# EasyEDA Pro project Remote_nodeIO_Hardware.eprj

# Schematic Schematic1
Board Name: Board1; Create Date: 2026-08-29; Page Name: P1; Project Name: Remote_nodeIO_Hardware; Schematic Name: Schematic1; Update Date: 2026-09-01; Company: EasyEDA.com; Page Size: A1; Version: V1.0
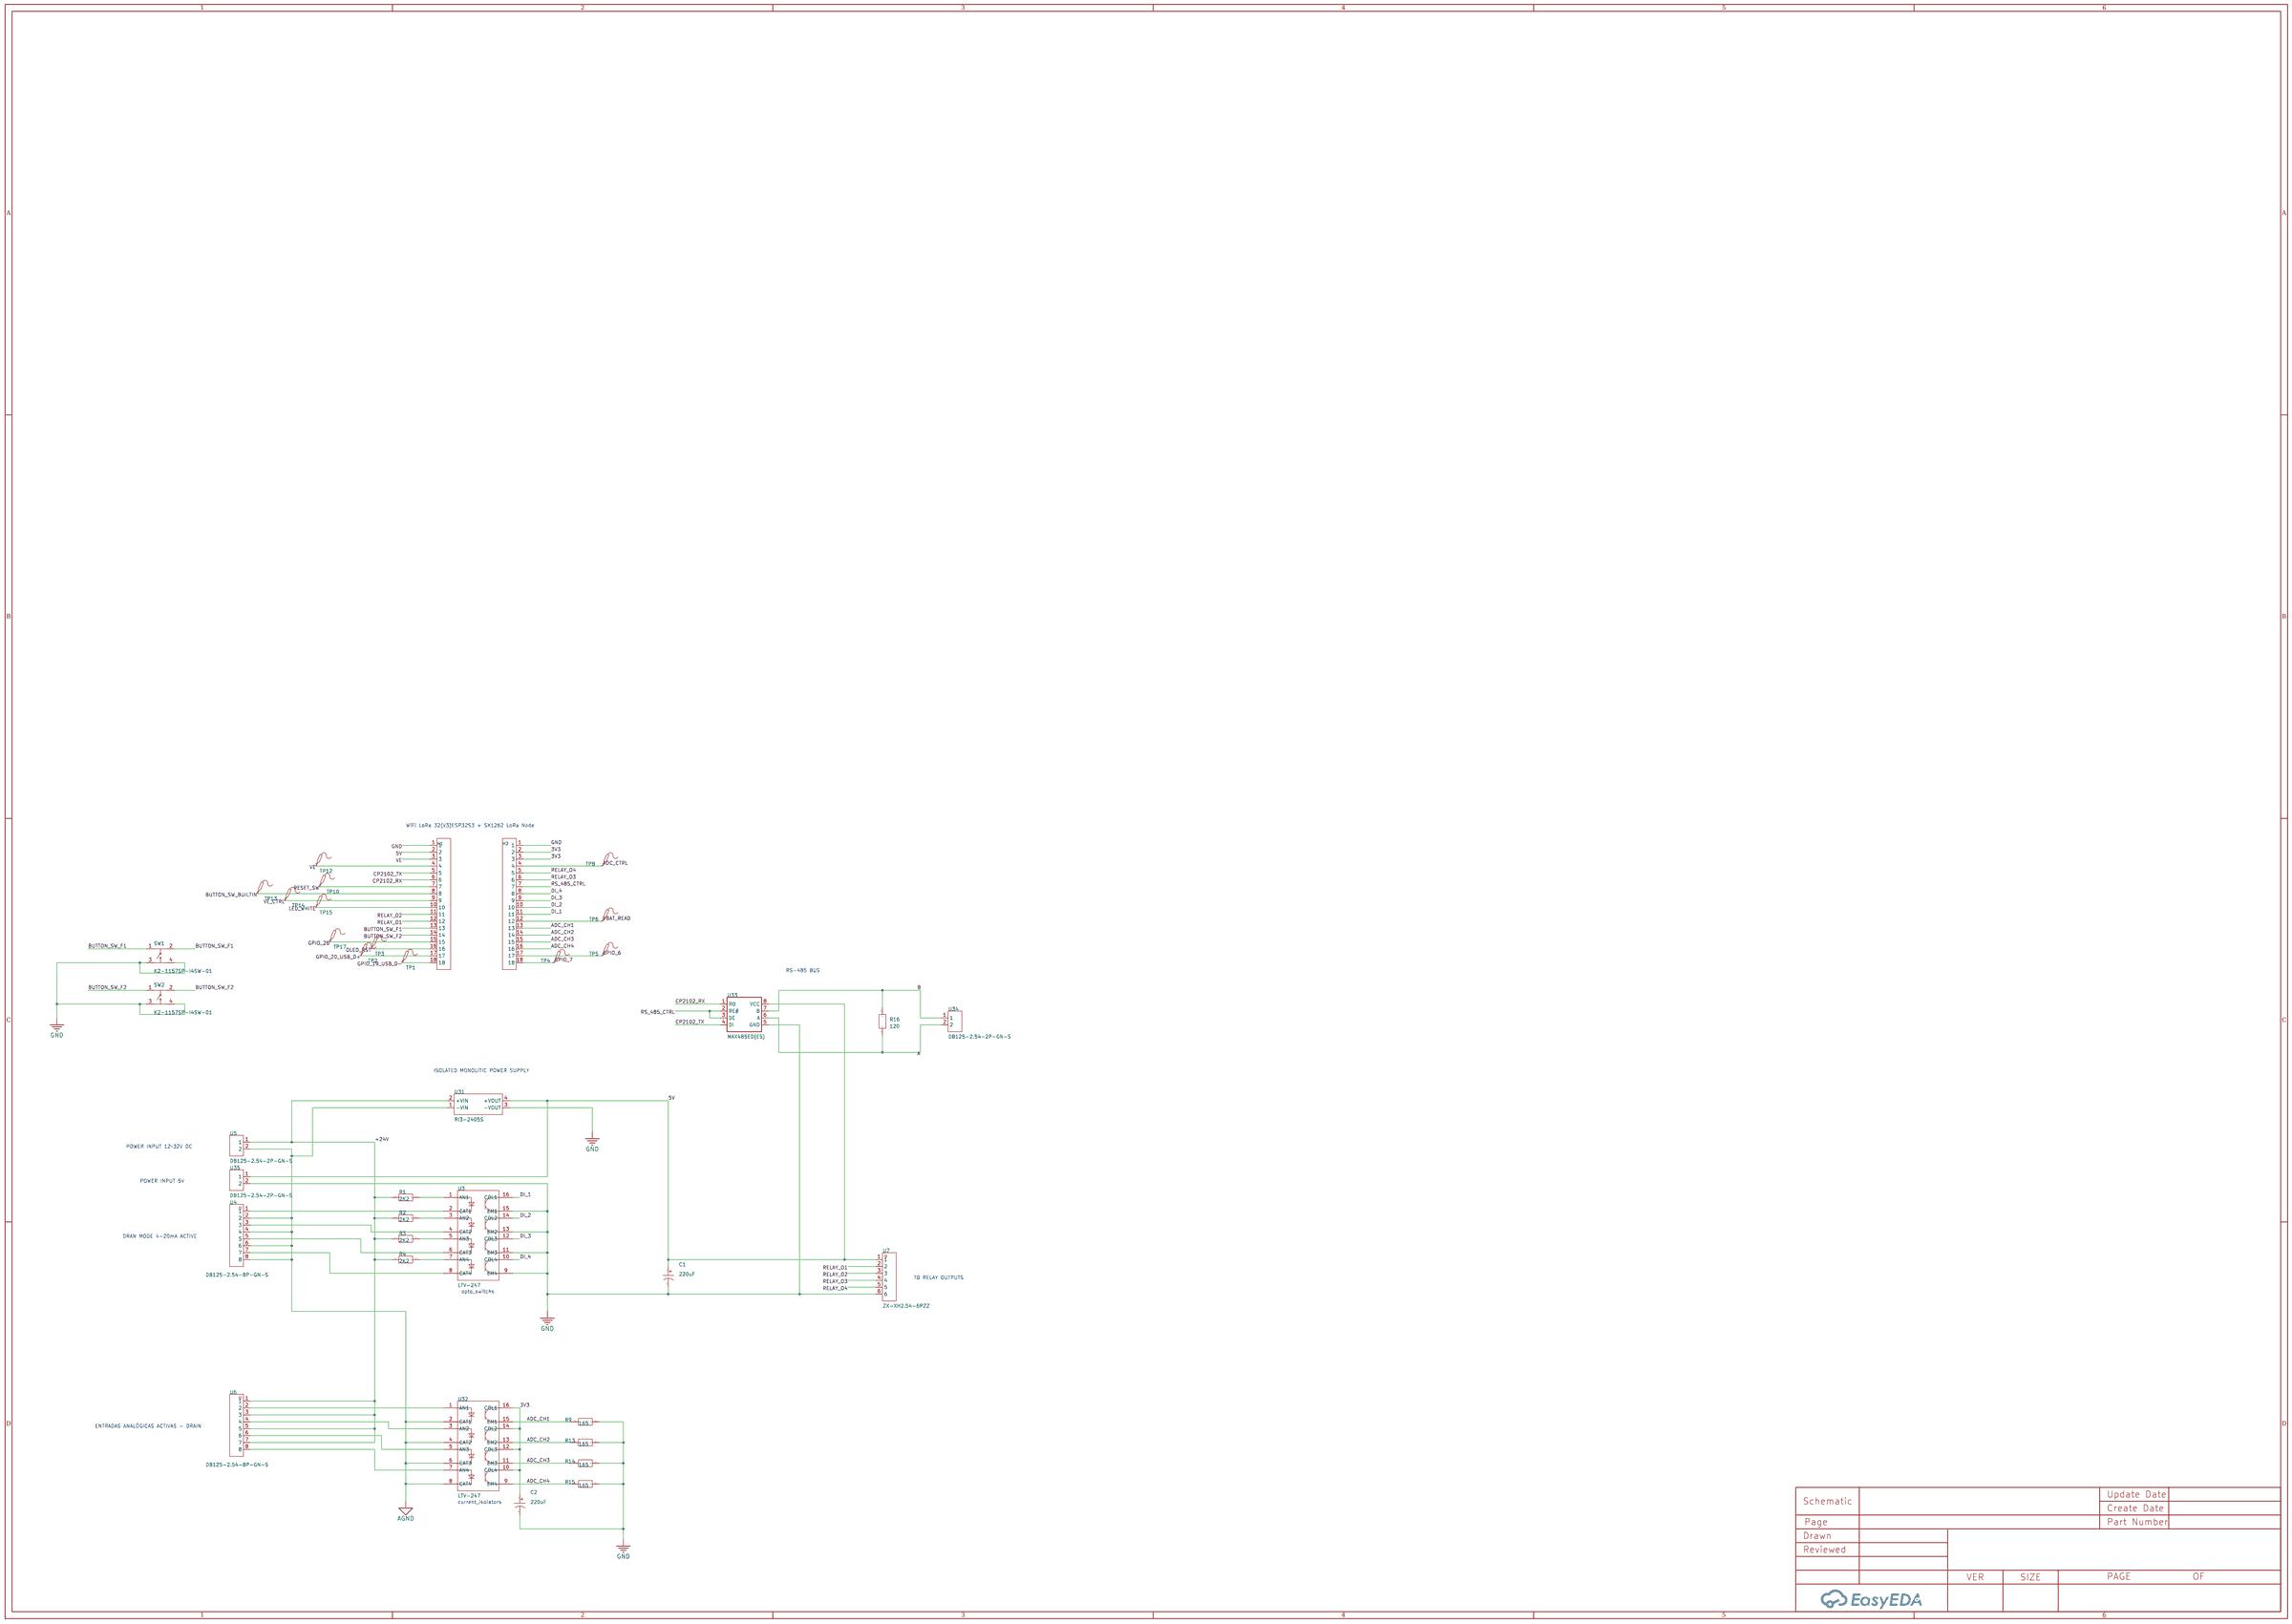
[diagram p0: schematic sheet]

## Parts
C1  220uF  [CAP-SMD_BD6.3-L6.6-W6.6-FD]
C2  220uF  [CAP-SMD_BD6.3-L6.6-W6.6-FD]
H1  PM254-1-18-Z-8.5  [HDR-TH_18P-P2.54-V-F]
H2  PM254-1-18-Z-8.5  [HDR-TH_18P-P2.54-V-F]
R1  2K2  [R1206]
R2  2K2  [R1206]
R3  2K2  [R1206]
R4  2K2  [R1206]
R9  165  [R1206]
R13  165  [R1206]
R14  165  [R1206]
R15  165  [R1206]
R16  120  [R1206]
SW1  K2-1157SP-I4SW-01  [SW-SMD_4P-L6.2-W6.2-P4.50-LS8.6]
SW2  K2-1157SP-I4SW-01  [SW-SMD_4P-L6.2-W6.2-P4.50-LS8.6]
TP1  -  [Test-Point-0.5mm]
TP2  -  [Test-Point-0.5mm]
TP3  -  [Test-Point-0.5mm]
TP4  -  [Test-Point-0.5mm]
TP5  -  [Test-Point-0.5mm]
TP6  -  [Test-Point-0.5mm]
TP8  -  [Test-Point-0.5mm]
TP10  -  [Test-Point-0.5mm]
TP12  -  [Test-Point-0.5mm]
TP13  -  [Test-Point-0.5mm]
TP14  -  [Test-Point-0.5mm]
TP15  -  [Test-Point-0.5mm]
TP17  -  [Test-Point-0.5mm]
U3  LTV-247  [SOP-16_L10.3-W5.4-P1.27-LS7.8-BL]
U4  DB125-2.54-8P-GN-S  [CONN-TH_DB125-2.54-8P-GN]
U5  DB125-2.54-2P-GN-S  [CONN-TH_DB125-2.54-2P-GN]
U6  DB125-2.54-8P-GN-S  [CONN-TH_DB125-2.54-8P-GN]
U7  ZX-XH2.54-6PZZ  [CONN-TH_6P-P2.50_ZX-XH2.54-6PZZ]
U31  RI3-2405S  [PWRM-TH_RI3-XXXXS]
U32  LTV-247  [SOP-16_L10.3-W5.4-P1.27-LS7.8-BL]
U33  MAX485ED(ES)  [SOIC-8_L5.0-W4.0-P1.27-LS6.0-BL]
U34  DB125-2.54-2P-GN-S  [CONN-TH_DB125-2.54-2P-GN]
U35  DB125-2.54-2P-GN-S  [CONN-TH_DB125-2.54-2P-GN]

## Library data of the parts
C1 C2 = RVT1A221M0605_C72494: LCSC Part Name: 220uF ±20% 10V; Supplier Part: C72494; Manufacturer: ROQANG(容强); Manufacturer Part: RVT1A221M0605; Supplier Footprint: SMD,D6.3xL5.4mm; JLCPCB Part Class: Extended Part; Datasheet: https://atta.szlcsc.com/upload/public/pdf/source/20170325/1490427950282.pdf; Supplier: LCSC; Tolerance: ±20%; Voltage Rating: 10V; Ripple Current: 90mA@120Hz; Diameter: 6.3mm; Height - Seated (Max): 5.4mm; Lifetime: 2000hrs@105℃; Operating Temperature: -40℃~+105℃
H1 H2 = PM254-1-18-Z-8.5_C3012090: LCSC Part Name: 1x18P 间距:2.54mm 直插; Supplier Part: C3012090; Manufacturer: HCTL(华灿天禄); Supplier Footprint: 插件,P=2.54mm; JLCPCB Part Class: Extended Part; Datasheet: https://item.szlcsc.com/datasheet/PM254-1-18-Z-8.5/3516561.html; Supplier: LCSC; Holes Structure: 1x18P; Pitch: 2.54mm; Circular Hole / Square Hole: Square Hole; Mounting Type: Through Hole; Number of Rows: 1; Number of Positions: 18P; Current Rating: 3A; Holes Direction: Top; Insulation Height: 8.5mm; Contact Material: Copper alloy; Operating Temperature: -40℃~+105℃
R1-R4 R9 R13-R16 = AS0606J036JT5E: LCSC Part Name: 3.6Ω ±5% 600mW 厚膜电阻; Supplier Part: C2770111; Manufacturer: UNI-ROYAL(厚声); Supplier Footprint: 1216; JLCPCB Part Class: Extended Part; Datasheet: https://item.szlcsc.com/datasheet/AS0606J036JT5E/2908566.html; Supplier: LCSC; Type: Thick Film Resistor; Tolerance: ±5%; Power(Watts): 600mW; Voltage-Supply(Max): 200V; Temperature Coefficient: ±400ppm/℃; Operating Temperature: -55℃~+155℃
SW1 SW2 = K2-1157SP-I4SW-01: LCSC Part Name: 6.4x6.2x3.7红柄开关; Supplier Part: C2909692; Manufacturer: 韩国韩荣; Supplier Footprint: SMD; JLCPCB Part Class: Extended Part; Datasheet: https://item.szlcsc.com/datasheet/K2-1157SP-I4SW-01/3187750.html; Supplier: LCSC; Actuator Style: Round Button; Mounting Type: Surface Mount,Vertical; Contact Current: 50mA; Voltage Rating: 12V; Actuator/Cap Color: Red; With Lamp: Without; Termination Style: Gull Wing; Operating Force: 2.5N; Operating Temperature: -25℃~+80℃; Life: 100,000 Cycles
TP1-TP6 TP8 TP10 TP12-TP15 TP17 = Test-Point
U3 U32 = LTV-247: LCSC Part Name: DC输入 隔离电压(rms):3750V; Supplier Part: C115451; Manufacturer: LITEON(光宝); Supplier Footprint: SOP-16-5.4mm; JLCPCB Part Class: Extended Part; Datasheet: https://item.szlcsc.com/datasheet/LTV-247/116699.html; Supplier: LCSC; Input type: DC; Output Type: Phototransistor; Voltage - Forward(Vf): 1.2V; Output Current: 50mA; Isolation Voltage(Vrms): 3.75kV; Reverse Voltage: 6V; Load Voltage: 80V; Number of Outputs: 4; Vce Saturation(VCE(sat)): 400mV@2.4mA,8mA; Fall time: 3us; Operating Temperature: -55℃~+110℃; Current Transfer Ratio (CTR) Minimum: 100%; Current Transfer Ratio (CTR) Maximum/Saturation Value: 600%; Total Power Dissipation(Pd): 170mW; Forward Current(If): 50mA
U4 U6 = DB125-2.54-8P-GN-S: LCSC Part Name: 1x8P 2.54mm 直插 排数:1 每排P数:8; Supplier Part: C918126; Manufacturer: DORABO(地博电气); Supplier Footprint: 插件,P=2.54mm; JLCPCB Part Class: Extended Part; Datasheet: https://item.szlcsc.com/datasheet/DB125-2.54-8P-GN-S/993705.html; Supplier: LCSC; Number of Positions or Pins: 1x8P; Pitch: 2.54mm; Color: Green; Mounting Type: Through Hole; Number of Pins: 8P; Number of Rows: 1; Number of PINs Per Row: 8; Screw Specification: M1.6; Current Rating: 7A; Voltage Rating (Max): 150V; Wire Gauge - AWG: 18~26; Wire Gauge - mm2: 1; Operating Temperature: -40℃~+105℃; Height Above Board: 8.4mm
U5 U34 U35 = DB125-2.54-2P-GN-S: LCSC Part Name: 1x2P 2.54mm 直插 排数:1 每排P数:2; Supplier Part: C918120; Manufacturer: DORABO(地博电气); Supplier Footprint: 插件,P=2.54mm; JLCPCB Part Class: Extended Part; Datasheet: https://item.szlcsc.com/datasheet/DB125-2.54-2P-GN-S/993699.html; Supplier: LCSC; Number of Positions or Pins: 1x2P; Pitch: 2.54mm; Color: Green; Mounting Type: Through Hole; Number of Pins: 2P; Number of Rows: 1; Number of PINs Per Row: 2; Screw Specification: M1.6; Current Rating: 7A; Voltage Rating (Max): 150V; Wire Gauge - AWG: 18~26; Wire Gauge - mm2: 1; Operating Temperature: -40℃~+105℃; Height Above Board: 8.4mm
U7 = ZX-XH2.54-6PZZ: LCSC Part Name: 1x6P 间距:2.5mm 直插 系列:XH; Supplier Part: C7429636; Manufacturer: Megastar(兆星); Supplier Footprint: 插件,P=2.5mm; JLCPCB Part Class: Extended Part; Datasheet: https://item.szlcsc.com/datasheet/ZX-XH2.54-6PZZ/8427553.html; Supplier: LCSC; Pins Structure: 1x6P; Pitch: 2.5mm; Mounting Type: Through Hole; Reference Series: XH; Number of Pins: 6P; Number of Rows: 1; Number of PINs Per Row: 6; Current Rating: 3A; Contact Material: Brass; Contact Plating: Tin; Operating Temperature: -25℃~+85℃; Voltage Rating: 250V; Plastic Material: PA66; Flame Retardant Rating: UL94V-0; Color: White; Z-Height of the Board: 7mm; X-Length of Bottom Edge on Board (Spacing Line): 17.5mm; Y-Width of Bottom Edge on Board: 5.9mm
U31 = RI3-2405S: Number of Channels:1 Output Power:3W Voltage - Supply:21.6V~26.4V Voltage - Supply:21.6V~26.4V Conversion Efficiency:86% Conversion Efficiency:86% Output Voltage:5V Output Voltage:5V Output Current(Max):600mA Output Current(Max):600mA Isolation Voltage(Vr; Supplier Part: C7049471; Manufacturer: Recom Power; Supplier Footprint: SIP,11.5x7.6mm; JLCPCB Part Class: Extended Part; Datasheet: https://item.szlcsc.com/datasheet/RI3-2405S/8016093.html; Supplier: LCSC; Number of Channels: 1; Output Power: 3W; Voltage - Supply: 21.6V~26.4V; Conversion Efficiency: 86%; Output Voltage: 5V; Output Current(Max): 600mA; Isolation Voltage(Vrms): 1kV
U33 = MAX485ED(ES): LCSC Part Name: 5.0V低功耗，±15kV ESD 保护, 2.5Mbps，半双工，32路负载RS485收发器; Supplier Part: C55471203; Manufacturer: ElecSuper(静芯); Supplier Footprint: SOP-8; JLCPCB Part Class: Extended Part; Datasheet: https://item.szlcsc.com/datasheet/MAX485ED(ES)/59450007.html; Supplier: LCSC

## Nets
3V3: C2.1 H2.2 H2.3 U32.10(COL4) U32.12(COL3) U32.14(COL2) U32.16(COL1)
5V: C1.1 H1.2 U7.1 U31.4(+VOUT) U33.8(VCC) U35.1
+24V: R1.1 R2.1 R3.1 R4.1 U5.1 U6.1 U6.3 U6.5 U6.7 U31.2(+VIN)
AGND: U4.2 U4.4 U4.6 U4.8 U5.2 U31.1(-VIN) U32.2(CAT1) U32.4(CAT2) U32.6(CAT3) U32.8(CAT4)
GND: C1.2 C2.2 H1.1 H2.1 R9.2 R13.2 R14.2 R15.2 SW1.3 SW1.4 SW2.3 SW2.4 U3.9(EM4) U3.11(EM3) U3.13(EM2) U3.15(EM1) U7.6 U31.3(-VOUT) U33.5(GND) U35.2
VBAT_READ: H2.12 TP6.1
A: R16.1 U33.6(A) U34.2
ADC_CH1: H2.13 R9.1 U32.15(EM1)
ADC_CH2: H2.14 R13.1 U32.13(EM2)
ADC_CH3: H2.15 R14.1 U32.11(EM3)
ADC_CH4: H2.16 R15.1 U32.9(EM4)
ADC_CTRL: H2.4 TP8.1
B: R16.2 U33.7(B) U34.1
BUTTON_SW_BUILTIN: H1.8 TP13.1
BUTTON_SW_F1: H1.13 SW1.1 SW1.2
BUTTON_SW_F2: H1.14 SW2.1 SW2.2
CP2102_RX: H1.6 U33.1(RO)
CP2102_TX: H1.5 U33.4(DI)
DI_1: H2.11 U3.16(COL1)
DI_2: H2.10 U3.14(COL2)
DI_3: H2.9 U3.12(COL3)
DI_4: H2.8 U3.10(COL4)
GPIO_6: H2.17 TP5.1
GPIO_7: H2.18 TP4.1
GPIO_19_USB_D-: H1.18 TP1.1
GPIO_20_USB_D+: H1.17 TP2.1
GPIO_26: H1.15 TP17.1
LED_WHITE: H1.10 TP15.1
OLED_RST: H1.16 TP3.1
RELAY_O1: H1.12 U7.2
RELAY_O2: H1.11 U7.3
RELAY_O3: H2.6 U7.4
RELAY_O4: H2.5 U7.5
RESET_SW: H1.7 TP10.1
RS_485_CTRL: H2.7 U33.2(RE#) U33.3(DE)
VE: H1.3 H1.4 TP12.1
VE_CTRL: H1.9 TP14.1
$R1_2: R1.2 U3.1(AN1)
$R2_2: R2.2 U3.3(AN2)
$R3_2: R3.2 U3.5(AN3)
$R4_2: R4.2 U3.7(AN4)
$U3_2: U3.2(CAT1) U4.1
$U3_4: U3.4(CAT2) U4.3
$U3_6: U3.6(CAT3) U4.5
$U3_8: U3.8(CAT4) U4.7
$U32_1: U6.2 U32.1(AN1)
$U32_3: U6.4 U32.3(AN2)
$U32_5: U6.6 U32.5(AN3)
$U32_7: U6.8 U32.7(AN4)

## Notes on the sheet
- WiFi LoRa 32(V3)ESP32S3 + SX1262 LoRa Node
- RS-485 BUS
- ISOLATED MONOLITIC POWER SUPPLY
- POWER INPUT 12~32V DC
- POWER INPUT 5V
- DRAN MODE 4-20mA ACTIVE
- TO RELAY OUTPUTS
- opto_switchs
- ENTRADAS ANALÓGICAS ACTIVAS - DRAIN
- current_isolators

# Board PCB1
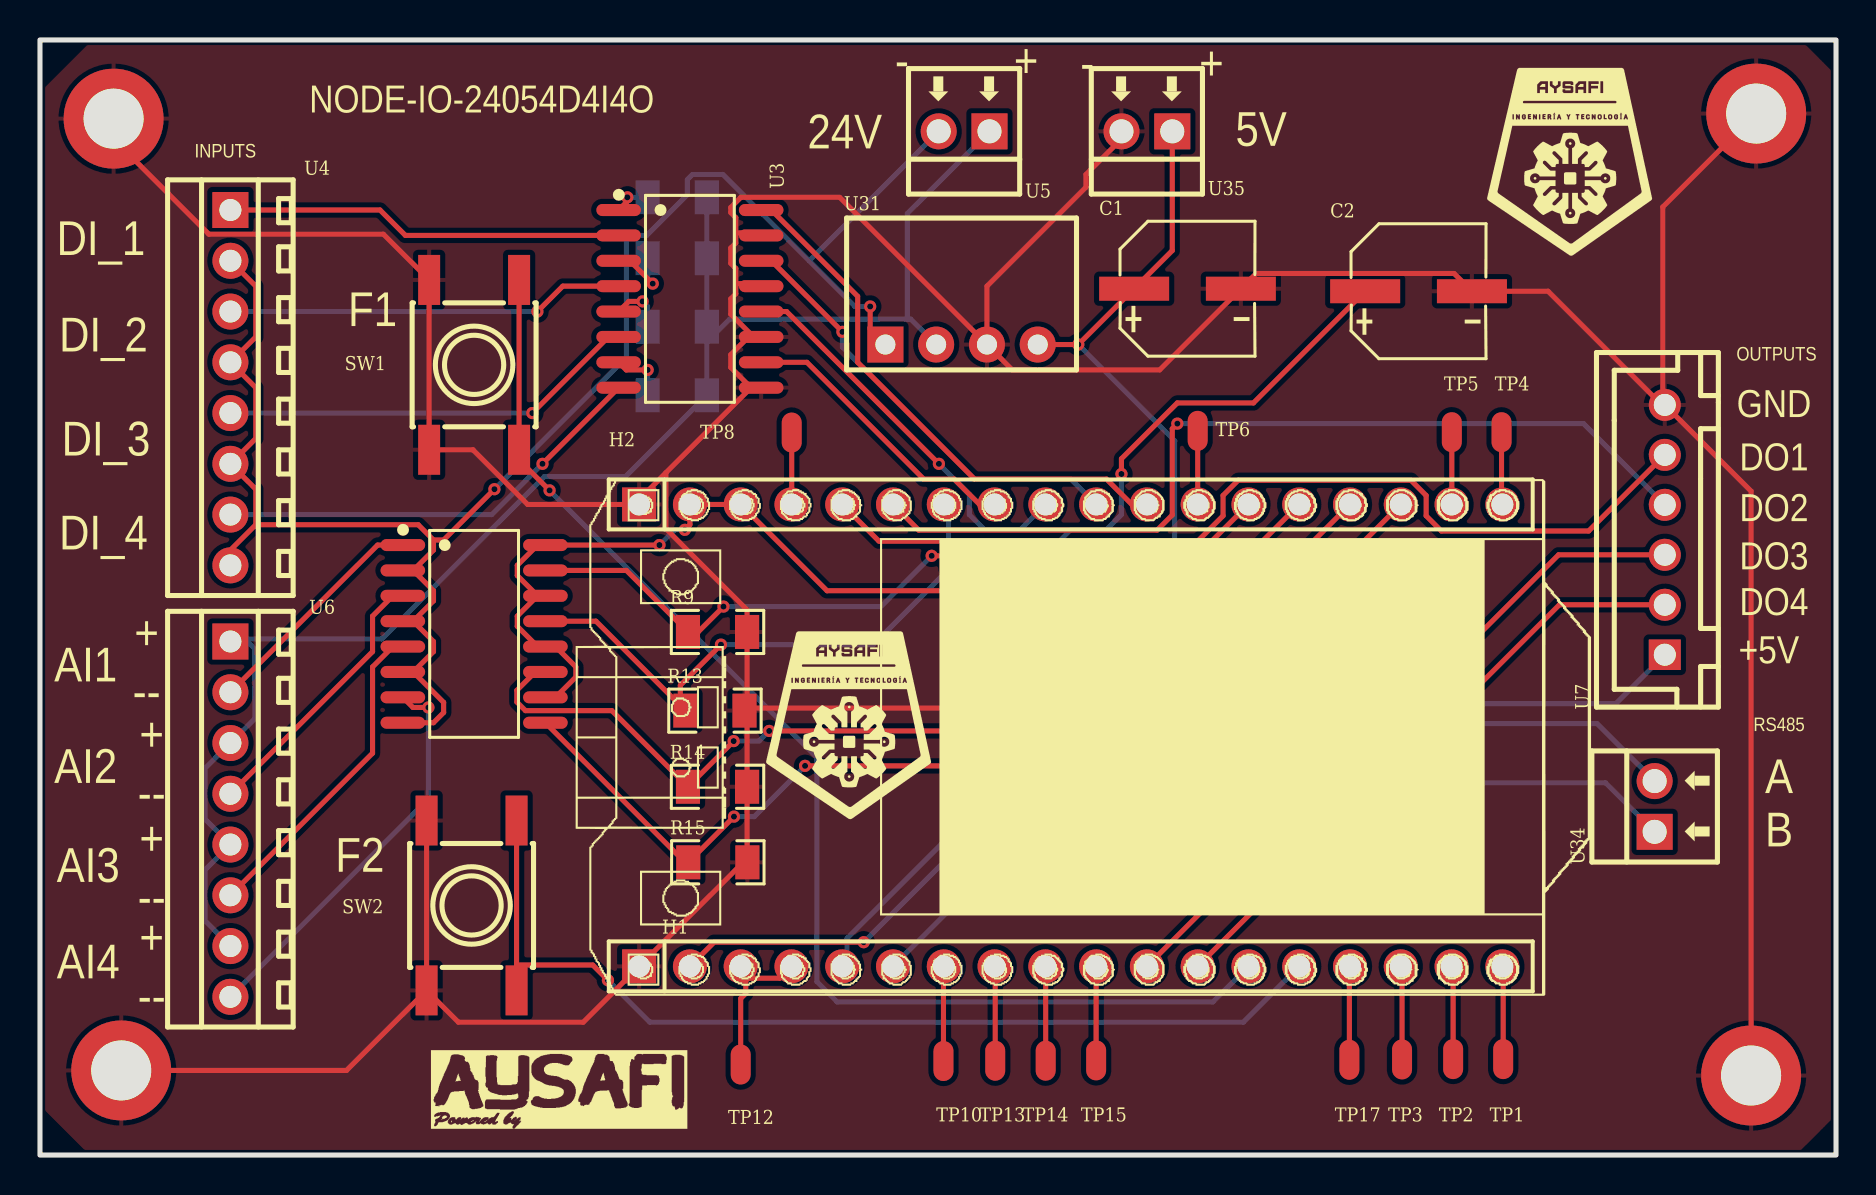
[diagram p1: board, top side]
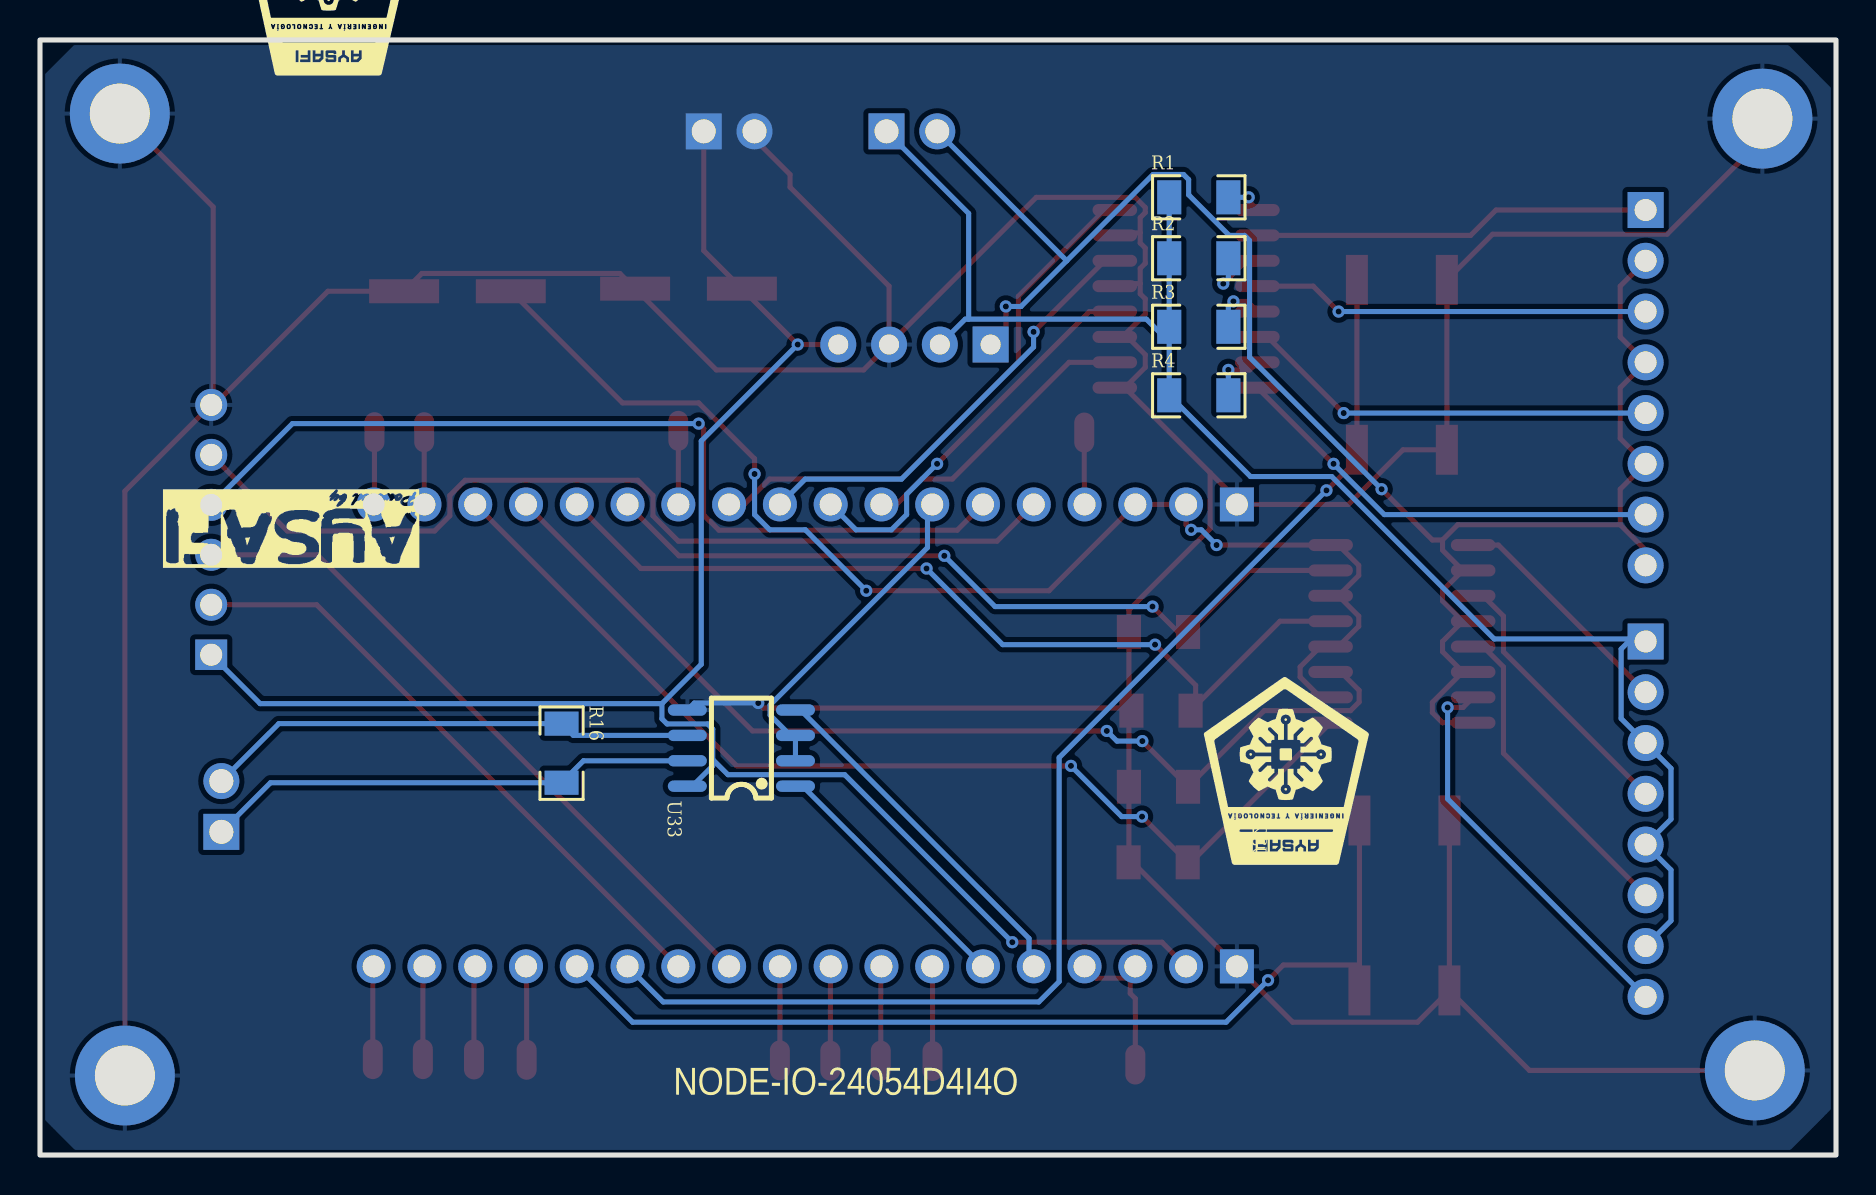
[diagram p2: board, bottom side, seen from below]

Outline 89.84 x 55.8 mm; copper layers: Top Layer, Bottom Layer. Coordinates in mm from the lower left corner of the outline.
Outline path: rectangle 0,55.8 89.84,0
Stack: Top Layer 0.035mm / Dielectric1 1.51mm FR4 er 4.5 / Bottom Layer 0.035mm

## Design rules (mm)
template: JLCPCB Capability(Two Layers Board)
spacing copperThickness1oz (default): track to track 0.102, other pairs 0.152 to 0.3
spacing copperThickness2oz: track to track 0.203, other pairs 0.152 to 0.3
track width copperThickness1oz (default): min 0.127, default 0.254, max 2.54
track width copperThickness2oz: min 0.203, default 0.254, max 2.54
differential pair differentialPair (default): width min 0.127, default 0.254, max 2.54; gap min 0.152, default 0.152
via viaSize (default): diameter min 0.5, default 0.61, max 10; hole min 0.3, default 0.305, max 6.3

## Placement (name value [footprint] x y rotation side)
C1  220uF  [CAP-SMD_BD6.3-L6.6-W6.6-FD]  57.4 43.35 0 top
C2  220uF  [CAP-SMD_BD6.3-L6.6-W6.6-FD]  68.96 43.22 0 top
H1  PM254-1-18-Z-8.5  [HDR-TH_18P-P2.54-V-F]  51.56 9.44 0 top
H2  PM254-1-18-Z-8.5  [HDR-TH_18P-P2.54-V-F]  51.56 32.55 0 top
NOREF  -  [Pad_e1902]  85.6 3.98 0 top
NOREF#2  -  [Pad_e1900]  85.85 52.11 0 top
NOREF#3  -  [Pad_e1904]  4.06 4.23 0 top
NOREF#4  -  [Pad_e1903]  3.68 51.86 0 top
R1  2K2  [R1206]  31.88 47.92 180 bottom
R2  2K2  [R1206]  31.88 44.87 180 bottom
R3  2K2  [R1206]  31.88 41.44 180 bottom
R4  2K2  [R1206]  31.88 38.02 180 bottom
R9  165  [R1206]  33.89 26.17 0 top
R13  165  [R1206]  33.77 22.24 0 top
R14  165  [R1206]  33.89 18.43 0 top
R15  165  [R1206]  33.91 14.65 0 top
R16  120  [R1206]  63.75 20.11 270 bottom
SW1  K2-1157SP-I4SW-01  [SW-SMD_4P-L6.2-W6.2-P4.50-LS8.6]  21.72 39.54 270 top
SW2  K2-1157SP-I4SW-01  [SW-SMD_4P-L6.2-W6.2-P4.50-LS8.6]  21.59 12.49 270 top
TP1  -  [Test-Point-0.5mm]  73.2 4.8 0 top
TP2  -  [Test-Point-0.5mm]  70.69 4.8 0 top
TP3  -  [Test-Point-0.5mm]  68.14 4.78 0 top
TP4  -  [Test-Point-0.5mm]  73.11 36.17 0 top
TP5  -  [Test-Point-0.5mm]  70.62 36.17 0 top
TP6  -  [Test-Point-0.5mm]  57.91 36.24 0 top
TP8  -  [Test-Point-0.5mm]  37.6 36.15 0 top
TP10  -  [Test-Point-0.5mm]  45.2 4.7 0 top
TP12  -  [Test-Point-0.5mm]  35.05 4.53 0 top
TP13  -  [Test-Point-0.5mm]  47.78 4.72 0 top
TP14  -  [Test-Point-0.5mm]  50.31 4.72 0 top
TP15  -  [Test-Point-0.5mm]  52.83 4.74 0 top
TP17  -  [Test-Point-0.5mm]  65.5 4.77 0 top
U3  LTV-247  [SOP-16_L10.3-W5.4-P1.27-LS7.8-BL]  32.51 42.84 270 top
U4  DB125-2.54-8P-GN-S  [CONN-TH_DB125-2.54-8P-GN]  9.53 38.4 270 top
U5  DB125-2.54-2P-GN-S  [CONN-TH_DB125-2.54-2P-GN]  46.23 51.22 180 top
U6  DB125-2.54-8P-GN-S  [CONN-TH_DB125-2.54-8P-GN]  9.53 16.81 270 top
U7  ZX-XH2.54-6PZZ  [CONN-TH_6P-P2.50_ZX-XH2.54-6PZZ]  81.28 31.28 90 top
U31  RI3-2405S  [PWRM-TH_RI3-XXXXS]  46.1 40.55 0 top
U32  LTV-247  [SOP-16_L10.3-W5.4-P1.27-LS7.8-BL]  21.72 26.08 270 top
U33  MAX485ED(ES)  [SOIC-8_L5.0-W4.0-P1.27-LS6.0-BL]  54.76 20.36 90 bottom
U34  DB125-2.54-2P-GN-S  [CONN-TH_DB125-2.54-2P-GN]  80.77 17.44 90 top
U35  DB125-2.54-2P-GN-S  [CONN-TH_DB125-2.54-2P-GN]  55.37 51.22 180 top

## Footprints (pads in the part's own frame, mm; a bottom-side part is the same pattern mirrored in y, then rotated)
CAP-SMD_BD6.3-L6.6-W6.6-FD
  rect 3.5x1.2 smd: 1(-2.67,0) 2(2.67,0)
CONN-TH_6P-P2.50_ZX-XH2.54-6PZZ
  rect 1.524x1.6 hole 1.1: 1(-6.25,0)
  round 1.6 hole 1.1: 2(-3.75,0) 3(-1.25,0) 4(1.25,0) 5(3.75,0) 6(6.25,0)
CONN-TH_DB125-2.54-2P-GN
  rect 1.8x1.8 hole 1.2: 1(-1.27,0)
  round 1.8 hole 1.2: 2(1.27,0)
CONN-TH_DB125-2.54-8P-GN
  rect 1.8x1.8 hole 1.1: 1(-8.89,0)
  round 1.8 hole 1.1: 2(-6.35,0) 3(-3.81,0) 4(-1.27,0) 5(1.27,0) 6(3.81,0) 7(6.35,0) 8(8.89,0)
HDR-TH_18P-P2.54-V-F
  rect 1.7x1.7 hole 1.1: 1(-21.59,0)
  round 1.7 hole 1.1: 2(-19.05,0) 3(-16.51,0) 4(-13.97,0) 5(-11.43,0) 6(-8.89,0) 7(-6.35,0) 8(-3.81,0) 9(-1.27,0) 10(1.27,0) 11(3.81,0) 12(6.35,0) 13(8.89,0) 14(11.43,0) 15(13.97,0) 16(16.51,0) 17(19.05,0) 18(21.59,0)
Pad_e1900
  round 5 hole 3: 1(0,0)
Pad_e1902
  round 5 hole 3: 1(0,0)
Pad_e1903
  round 5 hole 3: 1(0,0)
Pad_e1904
  round 5 hole 3: 1(0,0)
PWRM-TH_RI3-XXXXS
  rect 1.8x1.8 hole 1: 1(-3.81,0)
  round 1.8 hole 1: 2(-1.27,0) 3(1.27,0) 4(3.81,0)
R1206
  rect 1.208x1.701 smd: 1(-1.479,0) 2(1.479,0)
SOIC-8_L5.0-W4.0-P1.27-LS6.0-BL
  oval 0.569x1.95 smd: 1(-1.905,-2.705) 2(-0.635,-2.705) 3(0.635,-2.705) 4(1.905,-2.705) 5(1.905,2.705) 6(0.635,2.705) 7(-0.635,2.705) 8(-1.905,2.705)
SOP-16_L10.3-W5.4-P1.27-LS7.8-BL
  oval 0.602x2.231 smd: 1(-4.445,-3.566) 2(-3.175,-3.566) 3(-1.905,-3.566) 4(-0.635,-3.566) 5(0.635,-3.566) 6(1.905,-3.566) 7(3.175,-3.566) 8(4.445,-3.566) 9(4.445,3.566) 10(3.175,3.566) 11(1.905,3.566) 12(0.635,3.566) 13(-0.635,3.566) 14(-1.905,3.566) 15(-3.175,3.566) 16(-4.445,3.566)
SW-SMD_4P-L6.2-W6.2-P4.50-LS8.6
  rect 2.5x1.1 smd: 1(-4.25,2.25) 2(4.25,2.25) 3(-4.25,-2.25) 4(4.25,-2.25)
Test-Point-0.5mm
  oval 1x2 smd: 1(0,0)

## Nets
As in the schematic, except:
GND: C1.2 C2.2 H1.1 H2.1 NOREF.1 NOREF#2.1 NOREF#3.1 NOREF#4.1 R9.2 R13.2 R14.2 R15.2 SW1.3 SW1.4 SW2.3 SW2.4 U3.9 U3.11 U3.13 U3.15 U7.6 U31.3 U33.5 U35.2

## Via types
v1: diameter 0.61, hole 0.305, Top Layer to Bottom Layer, 30 vias

## Routing (per net, layer and track width the routed paths; a pad name or vN(x,y) marks a point on that pad's centre or on a via; arc(x,y) is an arc through that point)
3V3: length 64.4
  Top Layer w0.254: 24.89,27.98 23.88,29 23.88,29.51 24.89,30.52 U32.16 v1(30.99,30.52) ; 24.89,27.98 23.88,26.97 23.88,26.46 24.89,25.44 U32.12 25.79,25.44 26.81,24.43 26.81,23.92 25.79,22.9 U32.10 ; 24.89,27.98 U32.14 ; v1(32.26,31.28) 32.51,31.54 H2.2 H2.3 39.37,28.24 v1(48.51,28.24) ; v1(54.1,34.08) 54.1,34.84 56.89,37.63 60.7,37.63 C2.1
  Bottom Layer w0.254: v1(32.26,31.28) 31.75,31.28 v1(30.99,30.52) ; v1(48.51,28.24) 51.56,31.28 53.34,31.28 54.1,32.05 v1(54.1,34.08)
5V: length 94
  Top Layer w0.254: U35.1 56.64,45.26 C1.1 v1(51.94,40.55) U31.4 ; v1(41.21,10.65) 33.72,10.65 H1.2
  Bottom Layer w0.254: 58.73,22.59 56.77,24.55 56.77,35.73 v1(51.94,40.55) ; 58.73,22.59 58.73,21.83 58.48,21.57 56.45,21.57 56.19,21.32 56.19,19.79 ; 58.73,22.59 78.83,22.59 U7.1 ; 56.19,19.79 56.19,19.47 57.21,18.46 U33.8 ; 56.19,19.79 55.43,19.03 49.59,19.03 v1(41.21,10.65)
+24V: length 80.6
  Bottom Layer w0.254: 33.36,40.68 34.5,41.83 43.39,41.83 ; 33.36,40.68 R4.1 29.29,33.95 25.23,33.95 17.1,25.82 10.24,25.82 ; 33.36,40.68 R3.1 R2.1 R1.1 ; 10.24,25.82 10.75,25.31 10.75,21.84 U6.3 8.25,19.35 8.25,16.81 U6.5 8.25,14.27 8.25,11.73 U6.7 ; 10.24,25.82 9.65,25.82 U6.1 ; U31.2 43.56,41.83 43.39,41.83 ; U5.1 43.39,47.11 43.39,41.83
AGND: length 90.2
  Top Layer w0.254: U4.2 10.8,43.48 10.8,40.94 U4.4 10.8,38.4 10.8,35.86 U4.6 10.8,33.32 10.8,31.54 ; U4.8 9.53,30.27 10.8,31.54 ; U31.1 41.53,41.32 v1(41.53,42.46) ; 18.67,24.17 20.19,22.65 20.19,22.14 19.69,21.63 U32.8 ; 18.67,24.17 19.69,25.19 19.69,25.7 18.67,26.71 ; 18.67,24.17 U32.6 ; 18.67,29.25 U32.2 ; 18.67,29.25 19.69,30.27 19.69,30.78 ; 18.67,29.25 19.69,28.24 19.69,27.73 18.67,26.71 ; 19.69,30.78 18.92,31.54 10.8,31.54 ; 19.69,30.78 20.19,30.78 v1(22.73,33.32) ; 18.67,26.71 U32.4
  Bottom Layer w0.254: 38.48,44.75 40.77,42.46 v1(41.53,42.46) ; 38.48,44.75 34.16,49.06 32.64,49.06 32.38,48.81 32.38,48.05 30.35,46.02 29.59,46.02 29.34,45.76 29.34,39.92 v1(22.73,33.32) ; 38.48,44.75 U5.2
GND: length 272.1
  Top Layer w0.254: 34.81,43.6 35.95,43.6 U3.13 ; 34.81,43.6 34.81,43.09 34.55,42.84 34.55,42.08 35.57,41.06 ; 34.81,43.6 34.81,44.36 34.55,44.62 34.55,45.38 34.81,45.63 34.81,46.14 ; 34.81,46.14 35.95,46.14 U3.15 ; 34.81,46.14 34.81,46.91 34.55,47.16 34.55,47.41 35.06,47.92 40,47.92 U31.3 ; v1(53.91,22.62) 53.66,22.36 35.37,22.36 ; 35.37,22.36 35.25,22.24 35.37,22.11 R14.2 35.37,14.66 R15.2 35.18,14.65 H1.1 27.18,6.65 20.93,6.65 SW2.4 ; 35.37,22.36 R9.2 35.37,27.28 31.31,31.34 31.31,34.13 ; NOREF#3.1 15.33,4.23 SW2.4 ; U31.3 48.64,39.28 56.01,39.28 C1.2 60.84,44.11 70.74,44.11 C2.2 75.44,43.22 81.03,37.63 81.18,37.63 ; U31.3 47.37,43.48 52.32,48.43 52.32,49.06 54.1,50.84 U35.2 ; U3.11 35.95,41.06 35.57,41.06 ; SW2.4 SW2.3 ; 35.57,41.06 34.55,40.05 34.55,39.41 35.57,38.4 ; 31.31,34.13 29.98,32.81 ; 31.31,34.13 35.57,38.4 ; 81.18,37.63 81.18,47.44 NOREF#2.1 ; 81.18,37.63 U7.6 85.6,33.22 NOREF.1 ; 35.57,38.4 U3.9 ; 29.98,32.81 H2.1 ; 29.98,32.81 29.73,32.55 24.39,32.55 21.66,35.29 SW1.4 SW1.3 17.18,46.08 8.45,46.08 3.68,50.84 NOREF#4.1
  Bottom Layer w0.254: U33.5 57.11,22.62 v1(53.91,22.62)
VBAT_READ: length 3.7
  Top Layer w0.254: TP6.1 H2.12
$R1_2: length 1.8
  Top Layer w0.254: v1(29.38,47.92) 29.38,47.72 U3.1
  Bottom Layer w0.254: R1.2 v1(29.38,47.92)
$R2_2: length 3.6
  Top Layer w0.254: v1(30.65,43.6) 29.51,44.75 U3.3
  Bottom Layer w0.254: v1(30.65,43.6) 30.4,43.86 R2.2
$R3_2: length 2.8
  Top Layer w0.254: U3.5 29.45,42.71 v1(30.14,42.71)
  Bottom Layer w0.254: R3.2 30.4,42.46 v1(30.14,42.71)
$R4_2: length 2.9
  Top Layer w0.254: U3.7 29.33,39.28 v1(30.4,39.28)
  Bottom Layer w0.254: R4.2 v1(30.4,39.28)
$U3_2: length 19.9
  Top Layer w0.254: U3.2 18.28,46.02 17.01,47.29 U4.1
$U3_4: length 19.9
  Top Layer w0.254: U3.4 26.15,43.48 v1(24.88,42.21)
  Bottom Layer w0.254: v1(24.88,42.21) U4.3
$U3_6: length 21
  Top Layer w0.254: U3.6 28.44,40.94 v1(24.63,37.13)
  Bottom Layer w0.254: v1(24.63,37.13) U4.5
$U3_8: length 22.1
  Top Layer w0.254: U3.8 v1(25.14,34.59)
  Bottom Layer w0.254: U4.7 22.6,32.05 v1(25.14,34.59)
$U32_1: length 11.7
  Top Layer w0.254: U32.1 16.89,30.52 U6.2
$U32_3: length 13.8
  Top Layer w0.254: U32.3 17.65,27.98 16.64,26.97 16.64,25.19 U6.4
$U32_5: length 16.3
  Top Layer w0.254: U6.6 16.64,20.11 16.64,24.43 17.65,25.44 U32.5
$U32_7: length 20.1
  Top Layer w0.254: v1(19.43,22.39) 18.66,22.39 U32.7
  Bottom Layer w0.254: v1(19.43,22.39) 19.43,17.82 U6.8
A: length 24.7
  Bottom Layer w0.254: U34.2 77.9,21.59 R16.1 63.16,21 U33.6
ADC_CH1: length 39.1
  Top Layer w0.254: v1(44.61,29.98) 57.88,29.98 H2.13 ; v1(34.19,27.44) 32.92,26.17 R9.1 29.34,29.25 U32.15
  Bottom Layer w0.254: v1(34.19,27.44) 42.07,27.44 v1(44.61,29.98)
ADC_CH2: length 44.6
  Top Layer w0.254: R13.1 32.03,22.49 ; 32.03,22.49 27.81,26.71 U32.13 ; 32.03,22.49 32.03,23.51 v1(34.07,25.54) ; H2.14 59.79,29.35 v1(45.5,29.35)
  Bottom Layer w0.254: v1(45.5,29.35) 41.69,25.54 v1(34.07,25.54)
ADC_CH3: length 51.7
  Top Layer w0.254: U32.11 24.77,24.17 23.85,23.25 23.85,22.67 24.29,22.24 28.6,22.24 R14.1 v1(34.7,20.71) ; H2.15 54.2,21.22 v1(36.48,21.22)
  Bottom Layer w0.254: v1(34.7,20.71) 35.97,20.71 v1(36.48,21.22)
ADC_CH4: length 53.1
  Top Layer w0.254: v1(34.72,16.93) R15.1 32.27,14.65 U32.9 ; v1(38.27,19.47) 54.99,19.47 H2.16
  Bottom Layer w0.254: v1(34.72,16.93) 35.73,16.93 v1(38.27,19.47)
ADC_CTRL: length 3.6
  Top Layer w0.254: H2.4 37.6,32.57 TP8.1
B: length 24.8
  Bottom Layer w0.254: 80.77,16.17 78.31,18.63 R16.2 62.66,19.73 U33.7
BUTTON_SW_BUILTIN: length 4.7
  Top Layer w0.254: H1.8 47.78,9.41 TP13.1
BUTTON_SW_F1: length 64
  Top Layer w0.254: v1(25.49,33.26) 23.97,34.78 SW1.2 SW1.1
  Bottom Layer w0.254: H1.13 58.67,7.66 39.88,7.66 38.86,8.68 38.86,19.89 v1(25.49,33.26)
BUTTON_SW_F2: length 50
  Top Layer w0.254: v1(28.41,8.75) 27.65,9.51 23.84,9.51 ; 23.84,9.51 SW2.2 ; 23.84,9.51 SW2.1
  Bottom Layer w0.254: H1.14 60.2,6.65 30.51,6.65 v1(28.41,8.75)
CP2102_RX: length 13.1
  Bottom Layer w0.254: H1.6 51.69,18.46 U33.1
CP2102_TX: length 17.9
  Bottom Layer w0.254: U33.4 51.8,22.27 40.37,10.84 40.37,9.68 H1.5
DI_1: length 27.3
  Top Layer w0.254: U3.16 36.59,47.29 40.9,42.97 40.9,39.67 46.75,33.82 53.35,33.82 54.62,32.55 H2.11
DI_2: length 22.3
  Top Layer w0.254: U3.14 36.59,44.75 v1(40.14,41.19)
  Bottom Layer w0.254: H2.10 51.56,33.82 46.75,33.82 40.14,40.43 v1(40.14,41.19)
DI_3: length 19.9
  Top Layer w0.254: U3.12 37.35,42.21 v1(44.97,34.59)
  Bottom Layer w0.254: v1(44.97,34.59) 46.49,33.06 46.49,32.05 47.25,31.28 49.02,31.28 H2.9
DI_4: length 14.6
  Top Layer w0.254: H2.8 47,32.55 45.73,33.82 44.21,33.82 38.36,39.67 U3.10
GPIO_6: length 3.6
  Top Layer w0.254: TP5.1 70.62,32.57 H2.17
GPIO_7: length 3.6
  Top Layer w0.254: H2.18 73.11,32.59 TP4.1
GPIO_19_USB_D-: length 4.7
  Top Layer w0.254: TP1.1 73.2,9.4 H1.18
GPIO_20_USB_D+: length 4.7
  Top Layer w0.254: TP2.1 70.69,9.36 H1.17
GPIO_26: length 4.7
  Top Layer w0.254: TP17.1 65.5,9.41 H1.15
LED_WHITE: length 4.7
  Top Layer w0.254: TP15.1 H1.10
OLED_RST: length 4.7
  Top Layer w0.254: TP3.1 68.14,9.38 H1.16
RELAY_O1: length 30.9
  Top Layer w0.254: H1.12 76.01,27.53 U7.2
RELAY_O2: length 34.4
  Top Layer w0.254: U7.3 75.97,30.03 H1.11
RELAY_O3: length 45.6
  Top Layer w0.254: v1(56.9,36.6) 56.64,36.34 56.64,32.03 55.88,31.26 43.96,31.26 H2.6
  Bottom Layer w0.254: v1(56.9,36.6) 77.22,36.6 U7.4
RELAY_O4: length 47
  Top Layer w0.254: U7.5 77.47,31.22 70.1,31.22 69.34,31.99 69.34,33 68.58,33.76 59.94,33.76 59.18,33 59.18,31.99 57.91,30.72 41.97,30.72 H2.5
RESET_SW: length 4.7
  Top Layer w0.254: H1.7 45.2,9.42 TP10.1
RS_485_CTRL: length 16.9
  Bottom Layer w0.254: U33.2 U33.3 52.31,21 53.32,22.01 53.32,22.52 45.45,30.39 45.45,32.32 H2.7
VE: length 7.7
  Top Layer w0.254: 35.31,8.85 35.31,9.19 H1.3 ; 35.31,8.85 35.31,8.08 35.05,7.83 TP12.1 ; 35.31,8.85 37,8.85 H1.4
VE_CTRL: length 4.7
  Top Layer w0.254: H1.9 50.31,9.42 TP14.1

## Copper pours and planes (outline as drawn; the poured copper is in the pictures)
GND on Top Layer: 88.01,55.67 88.11,55.77 89.92,53.96 89.92,2.07 88.14,0.3 88.14,0.04 2.44,0.04 0,2.48 0,53.18 2.49,55.67
GND on Bottom Layer: 87.88,55.8 89.53,54.14 89.79,54.14 89.79,2.2 89.92,2.07 88.01,0.17 88.01,-0.09 2.62,-0.09 0,2.54 0,53.16 2.64,55.8

Small or netless copper shapes (teardrops, artwork), in the pictures only: 1 on Top Layer

## Text on the board
Bottom Silkscreen Layer: NODE-IO-24054D4I4O
Top Silkscreen Layer: INPUTS | OUTPUTS | RS485 | NODE-IO-24054D4I4O | +5V | GND | DO1 | DO2 | DO3 | DO4 | AI1 | AI2 | AI3 | AI4 | DI_1 | DI_2 | DI_4 | DI_3 | + / -- | F2 | F1 | 24V | -         + | 5V | A | B
